# EAGLE design Power Distribution (EAGLE 6.4)

## Sheet 1 of 5
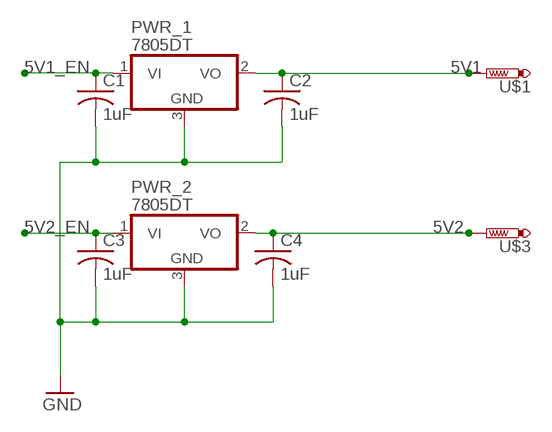
[diagram p0: schematic, sheet 1]

### Parts
C1  1uF  C-USC1206  [C1206]
C2  1uF  C-USC1206  [C1206]
C3  1uF  C-USC1206  [C1206]
C4  1uF  C-USC1206  [C1206]
PWR_1  7805DT  [TO252]
PWR_2  7805DT  [TO252]
U$1  TESTPAD-20MIL  [20MIL]
U$3  TESTPAD-20MIL  [20MIL]

### Nets
5V1: C2.1 PWR_1.2(VO) U$1.P$1(TP) ; also sheet 4
5V1_EN: C1.1 PWR_1.1(VI) ; also sheet 5
5V2: C4.1 PWR_2.2(VO) U$3.P$1(TP) ; also sheet 4
5V2_EN: C3.1 PWR_2.1(VI) ; also sheet 5
GND: C1.2 C2.2 C3.2 C4.2 PWR_1.3(GND) PWR_2.3(GND) ; also sheet 2,3,4

## Sheet 2 of 5
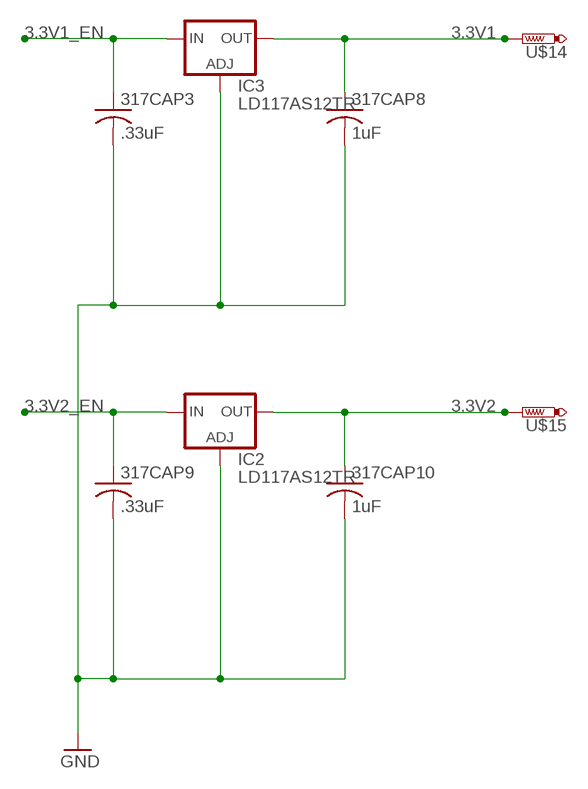
[diagram p1: schematic, sheet 2]

### Parts
317CAP3  .33uF  C-USC1206  [C1206]
317CAP8  1uF  C-USC1206  [C1206]
317CAP9  .33uF  C-USC1206  [C1206]
317CAP10  1uF  C-USC1206  [C1206]
IC2  LD117AS12TR  [SOT223]
IC3  LD117AS12TR  [SOT223]
U$14  TESTPAD-20MIL  [20MIL]
U$15  TESTPAD-20MIL  [20MIL]

### Nets
3.3V1: 317CAP8.1 IC3.4(OUT) U$14.P$1(TP) ; also sheet 4
3.3V1_EN: 317CAP3.1 IC3.3(IN) ; also sheet 5
3.3V2: 317CAP10.1 IC2.4(OUT) U$15.P$1(TP) ; also sheet 4
3.3V2_EN: 317CAP9.1 IC2.3(IN) ; also sheet 5
GND: 317CAP3.2 317CAP8.2 317CAP9.2 317CAP10.2 IC2.1(ADJ) IC3.1(ADJ) ; also sheet 1,3,4

## Sheet 3 of 5
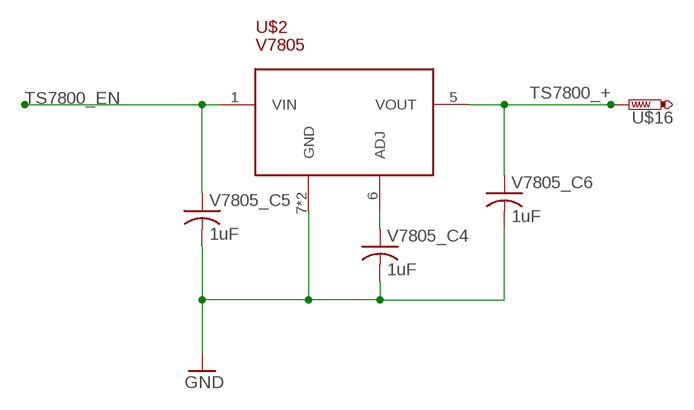
[diagram p2: schematic, sheet 3]

### Parts
U$2  V7805  [V7805]
U$16  TESTPAD-20MIL  [20MIL]
V7805_C4  1uF  C-USC1206  [C1206]
V7805_C5  1uF  C-USC1206  [C1206]
V7805_C6  1uF  C-USC1206  [C1206]

### Nets
GND: U$2.7(GND) U$2.9(GND) V7805_C4.2 V7805_C5.2 V7805_C6.2 ; also sheet 1,2,4
N$1: U$2.6(ADJ) V7805_C4.1
TS7800_+ [power]: U$2.5(VOUT) U$16.P$1(TP) V7805_C6.1 ; also sheet 4
TS7800_EN [power]: U$2.1(VIN) V7805_C5.1 ; also sheet 5

## Sheet 4 of 5
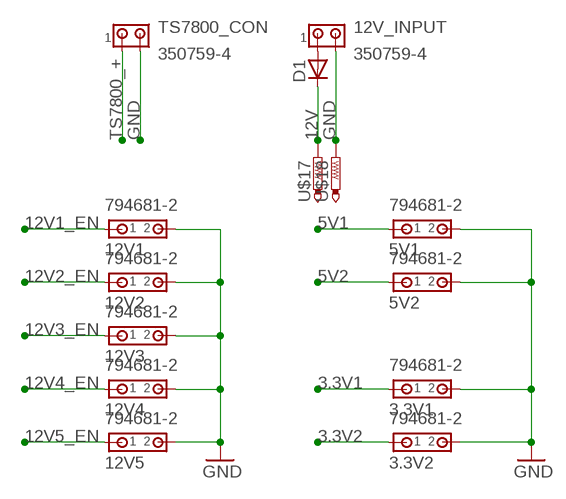
[diagram p3: schematic, sheet 4]

### Parts
3.3V1  794681-2  [794681-2]
3.3V2  794681-2  [794681-2]
5V1  794681-2  [794681-2]
5V2  794681-2  [794681-2]
12V1  794681-2  [794681-2]
12V2  794681-2  [794681-2]
12V3  794681-2  [794681-2]
12V4  794681-2  [794681-2]
12V5  794681-2  [794681-2]
12V_INPUT  350759-4  [350759-4]
D1  DIODE-SOD123  [SOD123]
TS7800_CON  350759-4  [350759-4]
U$17  TESTPAD-20MIL  [20MIL]
U$18  TESTPAD-20MIL  [20MIL]

### Nets
3.3V1: 3.3V1.1 ; also sheet 2
3.3V2: 3.3V2.1 ; also sheet 2
5V1: 5V1.1 ; also sheet 1
5V2: 5V2.1 ; also sheet 1
12V [power]: D1.C U$17.P$1(TP) ; also sheet 5
12V1_EN: 12V1.1 ; also sheet 5
12V2_EN: 12V2.1 ; also sheet 5
12V3_EN: 12V3.1 ; also sheet 5
12V4_EN: 12V4.1 ; also sheet 5
12V5_EN: 12V5.1 ; also sheet 5
GND: 3.3V1.2 3.3V2.2 5V1.2 5V2.2 12V1.2 12V2.2 12V3.2 12V4.2 12V5.2 12V_INPUT.2 TS7800_CON.2 U$18.P$1(TP) ; also sheet 1,2,3
N$3: 12V_INPUT.1 D1.A
TS7800_+ [power]: TS7800_CON.1 ; also sheet 3

## Sheet 5 of 5
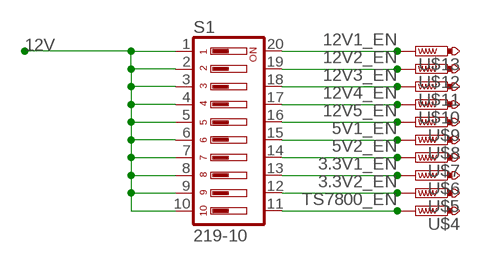
[diagram p4: schematic, sheet 5]

### Parts
S1  219-10  [CTS-219-10]
U$4  TESTPAD-20MIL  [20MIL]
U$5  TESTPAD-20MIL  [20MIL]
U$6  TESTPAD-20MIL  [20MIL]
U$7  TESTPAD-20MIL  [20MIL]
U$8  TESTPAD-20MIL  [20MIL]
U$9  TESTPAD-20MIL  [20MIL]
U$10  TESTPAD-20MIL  [20MIL]
U$11  TESTPAD-20MIL  [20MIL]
U$12  TESTPAD-20MIL  [20MIL]
U$13  TESTPAD-20MIL  [20MIL]

### Nets
3.3V1_EN: S1.13 U$6.P$1(TP) ; also sheet 2
3.3V2_EN: S1.12 U$5.P$1(TP) ; also sheet 2
5V1_EN: S1.15 U$8.P$1(TP) ; also sheet 1
5V2_EN: S1.14 U$7.P$1(TP) ; also sheet 1
12V [power]: S1.1 S1.2 S1.3 S1.4 S1.5 S1.6 S1.7 S1.8 S1.9 S1.10 ; also sheet 4
12V1_EN: S1.20 U$13.P$1(TP) ; also sheet 4
12V2_EN: S1.19 U$12.P$1(TP) ; also sheet 4
12V3_EN: S1.18 U$11.P$1(TP) ; also sheet 4
12V4_EN: S1.17 U$10.P$1(TP) ; also sheet 4
12V5_EN: S1.16 U$9.P$1(TP) ; also sheet 4
TS7800_EN [power]: S1.11 U$4.P$1(TP) ; also sheet 3

## Library data of the parts
3.3V1 3.3V2 5V1 5V2 12V1-12V5 = con-amp:794681-2: Micro MATE-N-LOK Connectors grid 1.5mm Dual Row Through Hole Vertical Metal Through Hole Holddowns Source: ENG_CD_794681_E.pdf
12V_INPUT TS7800_CON = con-amp:350759-4: Universal MATE-N-LOK .250" Centerline, 600 V, 19 - 36 A max Source: http://catalog.tycoelectronics.com/ .. ENG_CD_350759_R.pdf
317CAP3 317CAP8-317CAP10 C1-C4 V7805_C4-V7805_C6 = rcl:C-US: CAPACITOR, American symbol
D1 = diode:DIODE-: DIODE
IC2 IC3 = v-reg:LD117A?*: Low drop fixed and adjustable positive voltage regulators 1 A Source: http://www.st.com/stonline/products/literature/ds/7194/ld1117axx.pdf
PWR_1 PWR_2 = linear:78*: Positive VOLTAGE REGULATOR Source: http://cache.national.com/ds/LM/LM78L05.pdf http://www.fairchildsemi.com/ds/LM/LM7805.pdf
S1 = switch-dil:219-10*: Surface Mount DIP Switch Series 219 SMT CTS Electronic Components Sourc: www.ctscorp.com; MF: SLI (CML/IDI); MPN: 219-10PK; OC_FARNELL: unknown; OC_NEWARK: 19M0224
U$1 U$3-U$18 = LTC6803:TESTPAD-20MIL
U$2 = V7805:V7805

## Net classes
0 default: width 1.27 mm, drill 0.889 mm
1 power: width 1.27 mm, drill 0.889 mm

## Board
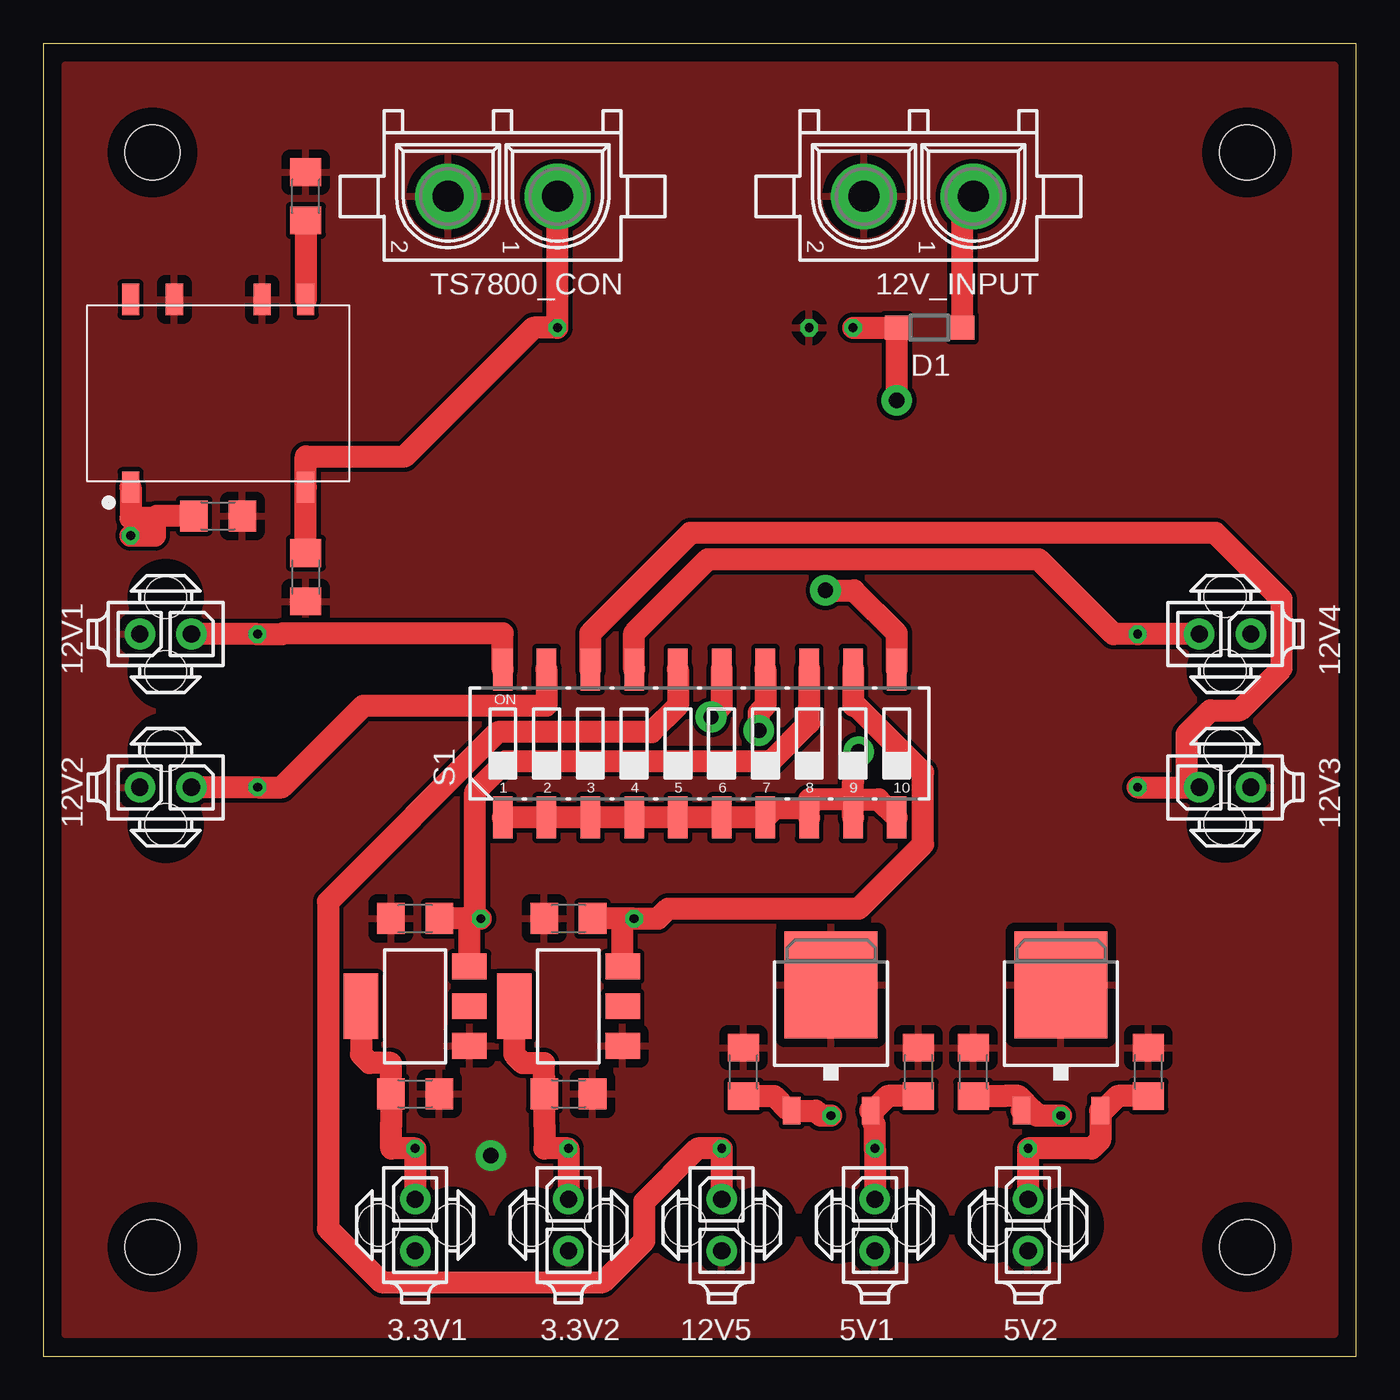
[diagram p5: board, top side]
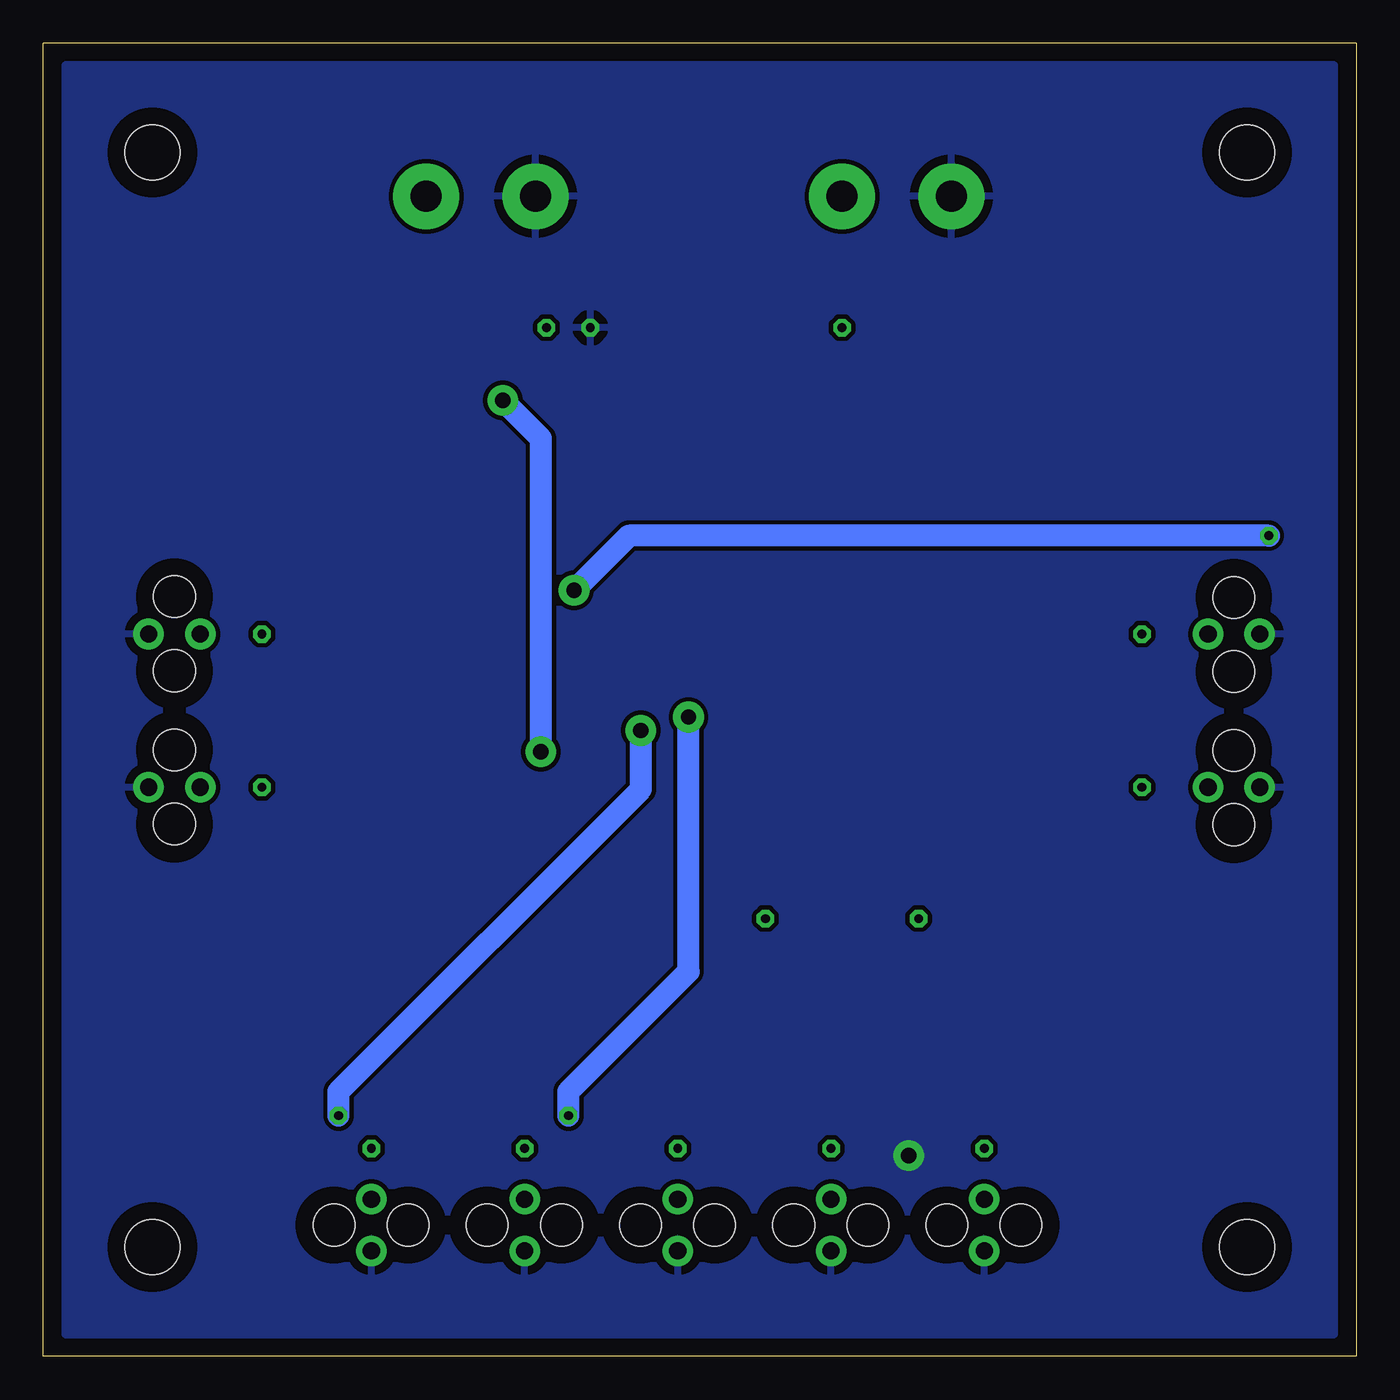
[diagram p6: board, bottom side, seen from below]

Size 76.2 x 76.2 mm. Coordinates in mm from the lower left corner, seen from the top.
Outline: 76.2,0 76.2,76.2 0,76.2 0,0 76.2,0
Copper layers (1*16): Top 0.035mm / dielectric 1.5mm / Bottom 0.035mm
Design rules "SJ Design Rules *": minimum track width 16mil, minimum drill 18mil, track to track 10mil, track to pad 10mil, pad to pad 10mil, via to via 10mil, smd to smd 10mil, copper to edge 40mil, drill to drill 10mil, minimum pad ring 10mil, minimum via ring 8mil, stop-mask expansion 4mil, vias tented up to drill 0mil, thermal gap 20mil
Holes 3.17 mm at 69.85,6.35 6.35,6.35 6.35,69.85 69.85,69.85
vRestrict: area 21.9,51.4 to 22,51.7; area 22,51.3 to 22,51.9; area 22,49.1 to 22,49.2; area 22,51.1 to 22,52; area 22,49.1 to 22,49.9; area 22,51.1 to 22.1,52.1; area 22,49.1 to 22.1,49.9; area 22.1,51 to 22.1,52.2; area 22.1,49.1 to 22.1,49.9; area 22.1,51 to 22.2,52.2; area 22.1,49.1 to 22.2,49.9; area 22.2,51 to 22.2,52.3; 2625 more areas

### Footprints (pad centres in the part's own frame; a part is rotated, then mirrored left to right if it is on the bottom)
794681-2 = drill 1 pad 1.778: 1 0,-1.5; 2 0,1.5 | hole 2.4: 2.13,0; -2.17,0
350759-4 = drill 1.8 pad 3.81: 1 -3.175,0; 2 3.175,0
C1206 = smd 1.6 x 1.8: 1 -1.4,0; 2 1.4,0
SOD123 = smd 1.4 x 1.4: A 1.9,0; C -1.9,0
SOT223 = smd 1.5 x 2: 1 -2.3,-3.15; 2 0,-3.15; 3 2.3,-3.15 | smd 3.8 x 2: 4 0,3.15
TO252 = smd 1 x 1.6: 1 -2.28,-4.8; 2 2.28,-4.8 | smd 5.4 x 6.2: 3 0,2.5
CTS-219-10 = smd 1.13 x 2.44: 1 -11.43,-4.3; 2 -8.89,-4.3; 3 -6.35,-4.3; 4 -3.81,-4.3; 5 -1.27,-4.3; 6 1.27,-4.3; 7 3.81,-4.3; 8 6.35,-4.3; 9 8.89,-4.3; 10 11.43,-4.3; 11 11.43,4.3; 12 8.89,4.3; 13 6.35,4.3; 14 3.81,4.3; 15 1.27,4.3; 16 -1.27,4.3; 17 -3.81,4.3; 18 -6.35,4.3; 19 -8.89,4.3; 20 -11.43,4.3
20MIL = drill 0.508 octagon: P$1 0,0
V7805 = smd 0.991 x 1.803: 1 0,0.902; 5 10.16,0.902; 6 10.16,11.798; 7 7.62,11.798; 9 2.54,11.798; 10 0,11.798

### Placement (x,y rotation side)
3.3V1  21.59,7.62 180 top
3.3V2  30.48,7.62 180 top
5V1  48.26,7.62 180 top
5V2  57.15,7.62 180 top
12V1  7.11,41.91 90 top
12V2  7.11,33.02 90 top
12V3  68.58,33.02 270 top
12V4  68.58,41.91 270 top
12V5  39.37,7.62 180 top
12V_INPUT  50.8,67.31 180 top
317CAP3  21.59,25.4 180 top
317CAP8  21.59,15.24 0 top
317CAP9  30.48,25.4 180 top
317CAP10  30.48,15.24 0 top
C1  40.64,16.51 90 top
C2  50.8,16.51 90 top
C3  53.98,16.51 90 top
C4  64.14,16.51 90 top
D1  51.44,59.69 0 top
IC2  30.48,20.32 90 top
IC3  21.59,20.32 90 top
PWR_1  45.72,19.05 0 top
PWR_2  59.05,19.05 0 top
S1  38.1,35.56 0 top
TS7800_CON  26.67,67.31 180 top
U$1  48.26,12.06 0 top
U$2  5.08,49.53 0 top
U$3  57.15,12.06 0 top
U$4  5.08,47.62 0 top
U$5  34.29,25.4 0 top
U$6  25.4,25.4 0 top
U$7  59.05,13.97 0 top
U$8  45.72,13.97 0 top
U$9  39.37,12.06 0 top
U$10  63.5,41.91 0 top
U$11  63.5,33.02 0 top
U$12  12.45,33.02 0 top
U$13  12.45,41.91 0 top
U$14  21.59,12.06 0 top
U$15  30.48,12.06 0 top
U$16  29.84,59.69 0 top
U$17  46.99,59.69 0 top
U$18  44.45,59.69 0 top
V7805_C4  15.24,67.31 90 top
V7805_C5  10.16,48.77 0 top
V7805_C6  15.24,45.21 270 top

### Tracks (layer width: path | path; a pad name or v marks a point on that pad's centre or on a via)
3.3V1
  Top 1.27: 3.3V1.1 U$14.P$1 20.19,12.06 20.19,13.45 317CAP8.1 20.19,17.03 18.94,17.03 18.44,17.53 IC3.4
3.3V1_EN
  Top 1.27: 25.07,25.4 25.07,32.76 26.85,34.54 42.25,34.54 44.45,36.74 44.45,37.75 S1.13 | 25.07,25.4 24.74,25.4 | U$6.P$1 25.07,25.4 | 24.74,25.4 317CAP3.1 | IC3.3 24.74,25.4
3.3V2
  Top 1.27: IC2.4 27.33,17.53 27.83,17.03 29.08,17.03 29.08,16.14 317CAP10.1 29.08,13.45 29.08,12.06 U$15.P$1 3.3V2.1
3.3V2_EN
  Top 1.27: 33.63,25.4 317CAP9.1 | 33.63,25.4 U$5.P$1 35.69,25.4 36.27,25.98 47.33,25.98 51.05,29.71 51.05,33.89 47.19,37.75 46.99,37.75 S1.12 | IC2.3 33.63,25.4
5V1
  Top 1.27: 48.15,14.25 48.15,13.57 48.26,13.46 U$1.P$1 5V1.1 | 48.15,14.25 49.01,15.11 C2.1 | PWR_1.2 48.15,14.25
5V1_EN  (via drill 0.89 pad 1.78)
  Top 1.27: S1.15 39.37,37.75 38.75,37.13 v38.75,37.1 | U$8.P$1 45.11,13.97 44.83,14.25 PWR_1.1 43.29,14.25 42.43,15.11 C1.1
  Bottom 1.27: U$8.P$1 45.72,15.37 38.75,22.34 v38.75,37.1
5V2
  Top 1.27: C4.1 62.35,15.11 61.49,14.25 PWR_2.2 61.34,12.56 60.84,12.06 U$3.P$1 5V2.1
5V2_EN  (via drill 0.89 pad 1.78)
  Top 1.27: S1.14 41.91,37.75 41.52,37.36 v41.52,36.32 | U$7.P$1 57.66,13.97 57.66,14.06 57.47,14.25 | C3.1 55.76,15.11 56.61,15.11 57.47,14.25 | PWR_2.1 57.47,14.25
  Bottom 1.27: U$7.P$1 59.05,15.37 41.52,32.91 v41.52,36.32
12V  (via drill 0.89 pad 1.78)
  Top 1.27: 44.45,31.79 42.44,31.79 S1.7 S1.6 S1.5 S1.4 S1.3 S1.2 S1.1 | 44.45,31.79 44.45,32.31 46.99,32.31 | S1.8 44.45,31.79 | 46.99,32.31 48.48,32.31 S1.10 | 46.99,32.31 46.99,33.37 46.99,34.76 v47.31,35.08 | S1.9 46.99,32.31 | v49.53,55.47 D1.C U$17.P$1
  Bottom 1.27: v47.31,35.08 47.31,53.26 v49.53,55.47
12V1_EN
  Top 1.27: 12V1.1 U$13.P$1 13.84,41.91 13.9,41.97 26.67,41.97 S1.20
12V2_EN
  Top 1.27: S1.19 29.21,37.75 18.57,37.75 13.84,33.02 U$12.P$1 12V2.1
12V3_EN
  Top 1.27: S1.18 31.75,41.97 37.55,47.77 68.02,47.77 71.86,43.93 71.86,39.92 69.42,37.48 67.73,37.48 66.35,36.11 66.35,33.02 | 66.35,33.02 12V3.1 | U$11.P$1 66.35,33.02
12V4_EN
  Top 1.27: 12V4.1 U$10.P$1 62.1,41.91 57.77,46.24 38.56,46.24 34.29,41.97 S1.17
12V5_EN
  Top 1.27: S1.16 36.83,37.75 35.31,36.23 26.38,36.23 16.52,26.37 16.52,7.42 19.64,4.3 32.49,4.3 34.88,6.7 34.88,8.97 37.97,12.06 U$9.P$1 12V5.1
GND  (via drill 0.89 pad 1.78)
  other vias: 25.98,11.66
  pour Top: 1.27,74.93 74.93,74.93 74.93,1.27 1.27,1.27
  pour Bottom: 1.27,74.93 74.93,74.93 74.93,1.27 1.27,1.27
N$1
  Top 1.27: V7805_C4.1 U$2.6
N$3
  Top 1.27: D1.A 53.34,66.67 12V_INPUT.1
TS7800_+
  Top 1.27: V7805_C6.1 U$2.5 15.24,52.22 20.98,52.22 28.45,59.69 U$16.P$1 TS7800_CON.1
TS7800_EN  (via drill 0.89 pad 1.78)
  Top 1.27: S1.11 49.53,41.97 47.05,44.45 v45.4,44.45 | V7805_C5.1 7.92,48.77 6.6,48.77 6.48,48.64 | 6.48,48.64 5.08,48.64 U$2.1 | 6.48,48.64 6.48,47.62 U$4.P$1
  Bottom 1.27: U$4.P$1 42.22,47.62 v45.4,44.45

### Text on the board
tValues: - | + | GND | 12V | Output Enables | 1. 12V1 / 2. 12V2 / 3. 12V3 / 4. 12V4 / 5. 12V5 / 6. 5V1 / 7. 5V2 / 8. 3.3V1 / 9. 3.3V2 / 10. TS7800 | v7805 | Power Distribution Board | 1 | Output Enables | 10
bValues: REV6 4/22/2013
vRestrict: Power Distribution Board